# EAGLE schematic rc360detector_102815 (EAGLE 7.4.0)
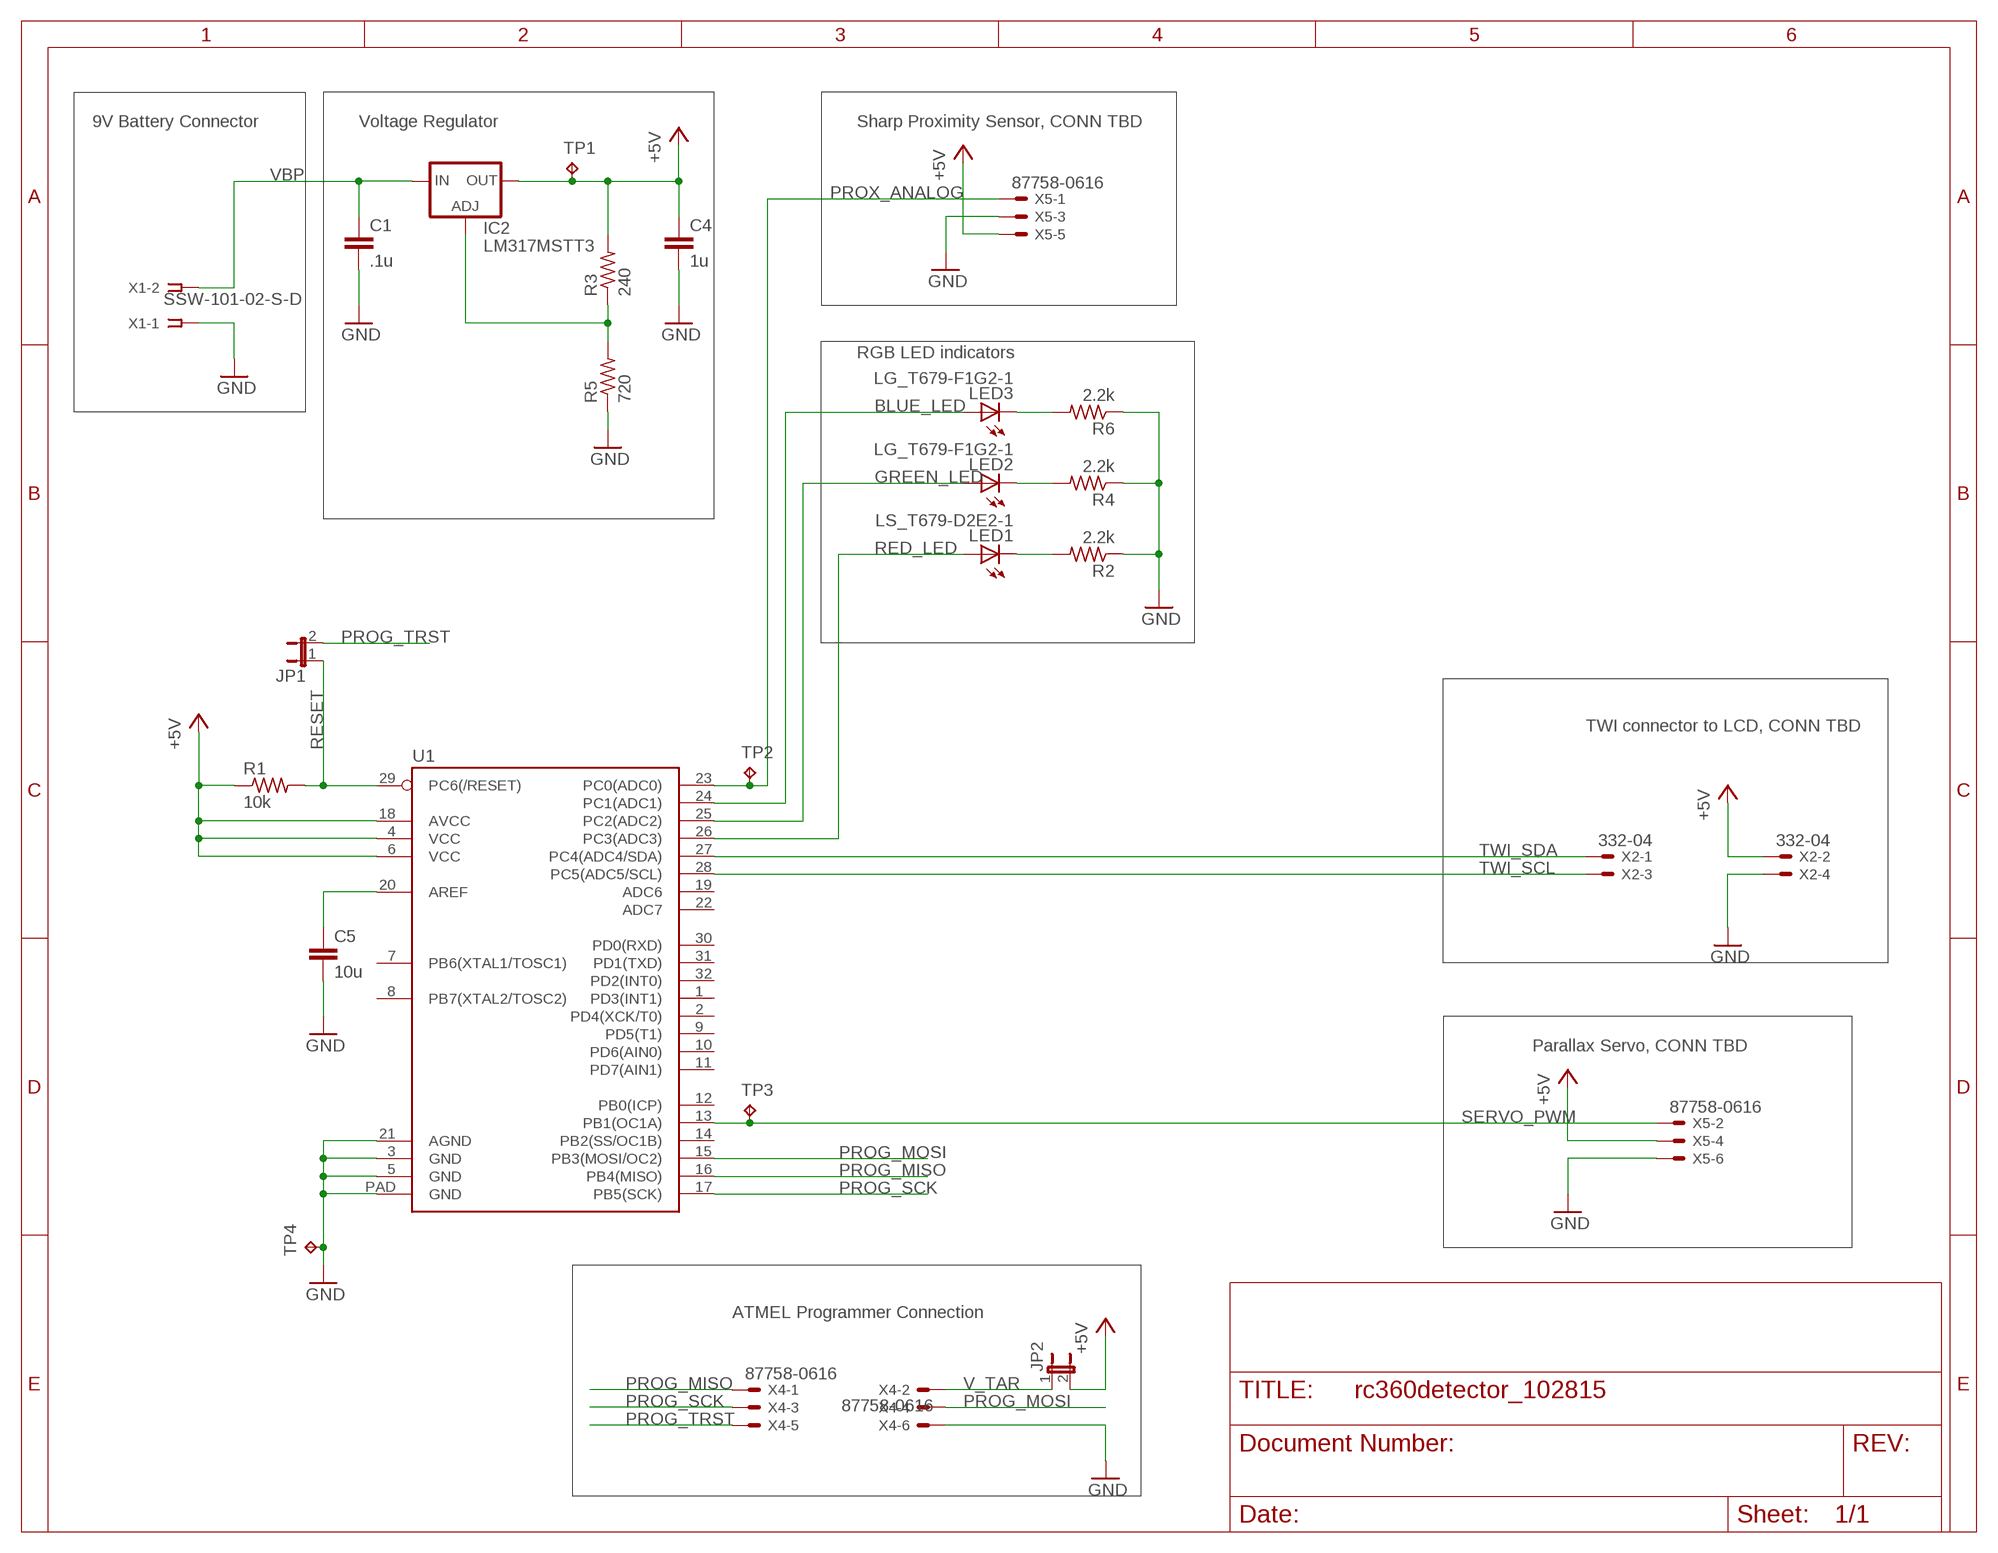
[diagram p0: schematic, sheet 1]

## Parts
C1  .1u  C-EUC0603  [C0603]
C4  1u  C-EUC0603  [C0603]
C5  10u  C-EUC0603  [C0603]
IC2  LM317MSTT3  [SOT223]
JP1  JP1E  [JP1]
JP2  JP1E  [JP1]
LED1  LS_T679-D2E2-1  [PLCC2]
LED2  LG_T679-F1G2-1  [PLCC2]
LED3  LG_T679-F1G2-1  [PLCC2]
R1  10k  R-US_R0603  [R0603]
R2  2.2k  R-US_R0805  [R0805]
R3  240  R-US_R0603  [R0603]
R4  2.2k  R-US_R0805  [R0805]
R5  720  R-US_R0603  [R0603]
R6  2.2k  R-US_R0805  [R0805]
TP1  TPPAD1-17  [P1-17]
TP2  TPPAD1-17  [P1-17]
TP3  TPPAD1-17  [P1-17]
TP4  TPPAD1-17  [P1-17]
U1  ATMEGA328P_MLFMLF32  [MLF32-PAD]
X1  SSW-101-02-S-D  [SSW-101-02-S-D]
X2  332-04  [332-04]
X4  87758-0616  [87758-0616]
X5  87758-0616  [87758-0616]

## Nets
+5V: C4.1 IC2.4(OUT) JP2.2 R1.1 R3.2 TP1.TP U1.4(VCC) U1.6(VCC) U1.18(AVCC) X2.2 X5.4 X5.5
AREF: C5.1 U1.20(AREF)
BLUE_LED: LED3.A U1.24(PC1(ADC1))
GND: C1.2 C4.2 C5.2 R2.1 R4.1 R5.1 R6.1 TP4.TP U1.3(GND) U1.5(GND) U1.21(AGND) U1.PAD(GND) X1.1 X2.4 X4.6 X5.3 X5.6
GREEN_LED: LED2.A U1.25(PC2(ADC2))
N$2: IC2.1(ADJ) R3.1 R5.2
N$5: LED3.C R6.2
N$7: LED2.C R4.2
N$8: LED1.C R2.2
PROG_MISO: U1.16(PB4(MISO)) X4.1
PROG_MOSI: U1.15(PB3(MOSI/OC2)) X4.4
PROG_SCK: U1.17(PB5(SCK)) X4.3
PROG_TRST: JP1.2 X4.5
PROX_ANALOG: TP2.TP U1.23(PC0(ADC0)) X5.1
RED_LED: LED1.A U1.26(PC3(ADC3))
RESET: JP1.1 R1.2 U1.29(PC6(/RESET))
SERVO_PWM: TP3.TP U1.13(PB1(OC1A)) X5.2
TWI_SCL: U1.28(PC5(ADC5/SCL)) X2.3
TWI_SDA: U1.27(PC4(ADC4/SDA)) X2.1
V_TAR: JP2.1 X4.2
VBP: C1.1 IC2.3(IN) X1.2
Unconnected: U1.1(PD3(INT1)) U1.2(PD4(XCK/T0)) U1.7(PB6(XTAL1/TOSC1)) U1.8(PB7(XTAL2/TOSC2)) U1.9(PD5(T1)) U1.10(PD6(AIN0)) U1.11(PD7(AIN1)) U1.12(PB0(ICP)) U1.14(PB2(SS/OC1B)) U1.19(ADC6) U1.22(ADC7) U1.30(PD0(RXD)) U1.31(PD1(TXD)) U1.32(PD2(INT0))

## Notes on the sheet
- 9V Battery Connector | Voltage Regulator | Sharp Proximity Sensor, CONN TBD
- RGB LED indicators
- TWI connector to LCD, CONN TBD
- Parallax Servo, CONN TBD
- ATMEL Programmer Connection

## Library data of the parts
C1 C4 C5 = rcl:C-EU: CAPACITOR, European symbol
IC2 = v-reg:LM317?*: 500 mA Adjustable Output Positive Voltage Regulator Source: http://www.onsemi.co.jp .. LM317M-D.PDF
JP1 JP2 = jumper:JP1E: JUMPER
LED1 = led:*_T679-?-1: LC TOPLED® Low Current LED Source: http://catalog.osram-os.com .. LG_LS_LY_T679_OBS.pdf; COLOR: super-red
LED2 LED3 = led:*_T679-?-1: LC TOPLED® Low Current LED Source: http://catalog.osram-os.com .. LG_LS_LY_T679_OBS.pdf; COLOR: green
R1-R6 = rcl:R-US_: RESISTOR, American symbol
TP1-TP4 = testpad:TP: Test pad
U1 = SparkFun-DigitalIC:ATMEGA328P_MLF: 32-Pin Atmega328 part Commonly used on Arduino compatible boards Available in QFP and QFN packages TQFP is IC-09069 QFN is non-stock
X1 = con-samtec:SSW-101-02-S-D: THROUGH-HOLE .025" SQ POST SOCKET Source: Samtec SSW.pdf; MPN: SSW-101-02-S-D; OC_FARNELL: unknown; OC_NEWARK: 82P1456
X2 = con-garry:332-04: 4 Pin - 2mm Dual Row Source: www.mpe-connector.de / garry_shortform_2012.pdf
X4 X5 = con-molex:87758-0616: 6 Pin - 2mm Dual Row Single Wafer, Vertical T/H HDR Source: http://www.molex.com/pdm_docs/sd/877580616_sd.pdf; MPN: 87758-0616; OC_FARNELL: 7472323; OC_NEWARK: 25M5667